# Altium project Slit_Lamp.PrjPcb (part 2 of 2)

## Sheet Motor_PCB.SchDoc: Low Power Motor Driver
size A; DrawnBy: Jesi Miranda-Santos; SheetNumber: 1; SheetTotal: 1
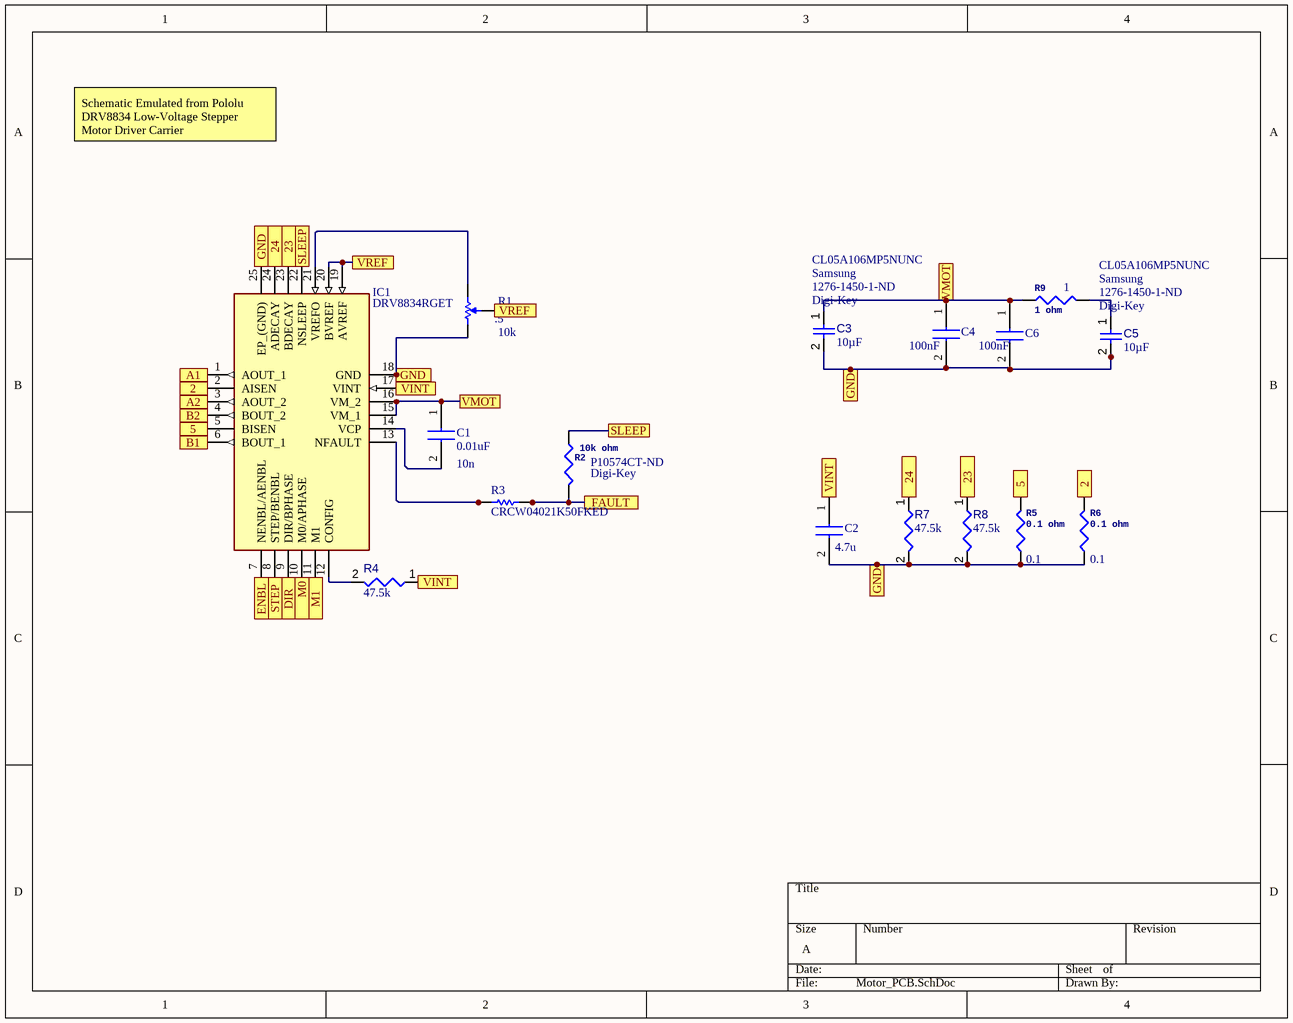
[diagram p1: Motor_PCB.SchDoc]

### Parts
C1  0.01uF  value 10n  [CAP 0603_1608]
C2  value 4.7u  [CAP 0402_1005]  (hidden comment: 0402YD475MAT2A)
C3  value 10µF  Supplier 1: Digi-Key  Supplier Part Number 1: 1276-1450-1-ND  Manufacturer 1: Samsung  Manufacturer Part Number 1: CL05A106MP5NUNC  [CAPC0402(1005)60_L]  (hidden comment: Capacitor 10µF +/-40% 6.3V 0402)
C4  Capacitance: 100nF  [CAP 0603_1608]  (hidden comment: TDK CGA3E2X7R1H104K080AA)
C5  value 10µF  Supplier 1: Digi-Key  Supplier Part Number 1: 1276-1450-1-ND  Manufacturer 1: Samsung  Manufacturer Part Number 1: CL05A106MP5NUNC  [CAPC0402(1005)60_L]  (hidden comment: Capacitor 10µF +/-40% 6.3V 0402)
C6  Capacitance: 100nF  [CAP 0603_1608]  (hidden comment: TDK CGA3E2X7R1H104K080AA)
IC1  DRV8834RGET  [QFN50P400X400X100-25N-D]
R1  value 10k  Set Position: .5  [BI-35WR10KLFTR-3_V]  (hidden comment: 35WR10KLFTR)
R2  10k ohm  Supplier 3: Digi-Key  Supplier Part Number 3: P10574CT-ND  [RES 0805_2012]
R3  CRCW04021K50FKED  [RESC1005X40X25NL05T05]
R4  value 47.5k  [RESC0402(1005)_L]  (hidden comment: Resistor 47K5 +/-1 % 0402 63 mW)
R5  0.1 ohm  value 0.1  [RES 1206_3216]
R6  0.1 ohm  value 0.1  [RES 1206_3216]
R7  value 47.5k  [RESC0402(1005)_L]  (hidden comment: Resistor 47K5 +/-1 % 0402 63 mW)
R8  value 47.5k  [RESC0402(1005)_L]  (hidden comment: Resistor 47K5 +/-1 % 0402 63 mW)
R9  1 ohm  value 1  [RES 0603_1608]

### Ports
2, 5, 23, 24, A1, A2, B1, B2, DIR, ENBL, FAULT, GND, M0, M1, SLEEP, STEP, VINT, VMOT, VREF

### Nets
5V: C1.1 C3.1 C4.1 C6.1 IC1.15(VM_1) IC1.16(VM_2) R9.1 ; port VMOT
GND: C2.2 C3.2 C4.2 C5.2 C6.2 IC1.18(GND) IC1.25(EP_(GND)) R1.1 R5.1 R6.1 R7.2 R8.2 ; port GND
NetC1_2: C1.2 IC1.14(VCP)
NetC2_1: C2.1 IC1.17(VINT) R4.1 ; port VINT
NetC5_1: C5.1 R9.2
NetIC1_1: IC1.1(AOUT_1) ; port A1
NetIC1_2: IC1.2(AISEN) R6.2 ; port 2
NetIC1_3: IC1.3(AOUT_2) ; port A2
NetIC1_4: IC1.4(BOUT_2) ; port B2
NetIC1_5: IC1.5(BISEN) R5.2 ; port 5
NetIC1_6: IC1.6(BOUT_1) ; port B1
NetIC1_7: IC1.7(NENBL/AENBL) ; port ENBL
NetIC1_8: IC1.8(STEP/BENBL) ; port STEP
NetIC1_9: IC1.9(DIR/BPHASE) ; port DIR
NetIC1_10: IC1.10(M0/APHASE) ; port M0
NetIC1_11: IC1.11(M1) ; port M1
NetIC1_12: IC1.12(CONFIG) R4.2
NetIC1_13: IC1.13(NFAULT) R3.1
NetIC1_19: IC1.19(AVREF) IC1.20(BVREF) R1.2 ; port VREF
NetIC1_21: IC1.21(VREFO) R1.3
NetIC1_22: IC1.22(NSLEEP) R2.1 ; port SLEEP
NetIC1_23: IC1.23(BDECAY) R8.1 ; port 23
NetIC1_24: IC1.24(ADECAY) R7.1 ; port 24
NetR2_2: R2.2 R3.2 ; port FAULT

### Notes on the sheet
- Schematic Emulated from Pololu
  DRV8834 Low-Voltage Stepper Motor Driver Carrier

### Library data of the parts
C1 = 06031C103K4T2A: Capacitor 0.01uF / 06031C103K4T2A; Manufacturer_Name: AVX; Datasheet Link: http://www.mouser.com/catalog/supplier/library/pdf/AVXSurfaceMountCeramic.pdf; Height: 0.9mm; Manufacturer_Part_Number: 06031C103K4T2A; Arrow Part Number: 06031C103K4T2A; Arrow Price/Stock: https://www.arrow.com/en/products/06031c103k4t2a/avx; Mouser Part Number: 581-06031C103K4T2A; Mouser Price/Stock: https://www.mouser.com/Search/Refine.aspx?Keyword=581-06031C103K4T2A; Supplier 1: Digi-Key; Supplier Part Number 1: 478-9371-1-ND; Supplier 2: Newark; Supplier Part Number 2: 38AH3523
C2 = 0402YD475MAT2A: Ceramic Capacitor, Multilayer, Ceramic, 6.3V, 20% +Tol, 20% -Tol, X5R, 15% TC, 4.7uF, Surface Mount, 0402; Manufacturer: AVX; Manufacturer 1: Murata; Manufacturer Part Number 1: GRM155R60J475ME47D; Datasheet Link: http://www.mouser.com/catalog/supplier/library/pdf/AVXSurfaceMountCeramic.pdf; Height: 0.56mm; Manufacturer Part Number: 0402YD475MAT2A; Arrow Part Number: 0402YD475MAT2A; Mouser Part Number: 581-0402YD475MAT2A; Mouser Price/Stock: https://www.mouser.co.uk/ProductDetail/AVX/0402YD475MAT2A?qs=s6nfgz3miVxwCmHE9M6tUg%3D%3D; Supplier 2: Future Electronics; Supplier Part Number 2: 0402YD475MAT2A-CUTT; Supplier 1: Arrow; Supplier Part Number 1: GRM155R60J475ME47D; RoHS: Yes; Category: Ceramic Capacitors; Stock 3: 138; Pricing 3: 1=0.09380, 10=0.07840, 25=0.07770, 100=0.05870, 250=0.04460, 500=0.03180, 1000=0.02760, 3000=0.02540 (USD); Mount: Surface Mount; Case/Package: 0402; Weight: 0.000212oz; Case Code (Metric): 1005; Case Code (Imperial): 0402; Contact Plating: Tin; Min Operating Temperature: -55°C; Max Operating Temperature: 85°C; Capacitance: 4.7uF; Tolerance: 20%; Packaging: Tape and Reel; Voltage Rating (DC): 6.3V; Package Quantity: 10000; Voltage Rating: 6.3V; Dielectric: X5R; Termination: SMD/SMT; Voltage: 6.3V; Length: 1mm; Depth: 0.5mm; Width: 0.02inch; Thickness: 0.022inch; REACH SVHC: No SVHC; Lead Free: Lead Free; ComponentLink1URL: https://datasheet.ciiva.com:443/pdfs/VipMasterIC/IC/MURE/MURE-S-A0008911298/MURE-S-A0008911388-1.pdf?src-supplier=IHS+Markit; ComponentLink1Description: https://datasheet.ciiva.com:443/pdfs/VipMasterIC/IC/MURE/MURE-S-A0008911298/MURE-S-A0008911388-1.pdf?src-supplier=IHS+Markit; ComponentLink2URL: https://datasheet.ciiva.com/6270/product-6270483.pdf?src-supplier=Digi-Key; ComponentLink2Description: https://datasheet.ciiva.com/6270/product-6270483.pdf?src-supplier=Digi-Key; ComponentLink3URL: https://datasheet.ciiva.com/6268/partnumbering-e-01-6268378.pdf?src-supplier=Digi-Key; ComponentLink3Description: https://datasheet.ciiva.com/6268/partnumbering-e-01-6268378.pdf?src-supplier=Digi-Key; ComponentLink4URL: https://datasheet.ciiva.com/46418/1769893-46418044.pdf?src-supplier=Element14; ComponentLink4Description: https://datasheet.ciiva.com/46418/1769893-46418044.pdf?src-supplier=Element14; ComponentLink5URL: https://datasheet.ciiva.com/46418/1769893-46418045.pdf?src-supplier=Element14; ComponentLink5Description: https://datasheet.ciiva.com/46418/1769893-46418045.pdf?src-supplier=Element14; ComponentLink6URL: https://datasheet.ciiva.com/6268/partnumbering-e-01-6268382.pdf?src-supplier=Digi-Key; ComponentLink6Description: https://datasheet.ciiva.com/6268/partnumbering-e-01-6268382.pdf?src-supplier=Digi-Key
C3 C5 = CMP-001-00074-2: Chip Capacitor, 10µF +/-40%, 6.3V, 0402, Thickness 0.6 mm; Tolerance: 10%; Capacitance: 10uF; Dielectric: X5R; Max Operating Temperature: 85°C; Pins: 2; Case/Package: 0402; Min Operating Temperature: -55°C; Voltage Rating: 6.3V; Mounting Technology: SMT; RoHS: Yes; Category: Ceramic Capacitors; Stock 1: 40; Pricing 1: 1=0.22000, 10=0.14900, 50=0.08920, 100=0.07540, 500=0.05156, 1000=0.04562, 2500=0.04363, 5000=0.03967 (USD); Mount: Surface Mount; Case Code (Metric): 1005; Case Code (Imperial): 0402; Contact Plating: Tin; Packaging: Tape and Reel; Package Quantity: 1; Termination: Wraparound; Length: 1mm; Width: 0.02inch; Thickness: 0.028inch; Depth: 0.5mm; Radiation Hardening: No; Lead Free: Lead Free; ComponentLink1URL: https://datasheet.ciiva.com:443/pdfs/VipMasterIC/IC/SEMS/SEMS-S-A0008384515/SEMS-S-A0008872829-1.pdf?src-supplier=IHS+Markit; ComponentLink1Description: https://datasheet.ciiva.com:443/pdfs/VipMasterIC/IC/SEMS/SEMS-S-A0008384515/SEMS-S-A0008872829-1.pdf?src-supplier=IHS+Markit; ComponentLink2URL: https://datasheet.ciiva.com/25721/cl05a106mp5nunc-25721584.pdf?src-supplier=Digi-Key; ComponentLink2Description: https://datasheet.ciiva.com/25721/cl05a106mp5nunc-25721584.pdf?src-supplier=Digi-Key; ComponentLink3URL: https://datasheet.ciiva.com/26838/getdatasheetpartid-745310-26838170.pdf?src-supplier=Verical; ComponentLink3Description: https://datasheet.ciiva.com/26838/getdatasheetpartid-745310-26838170.pdf?src-supplier=Verical
C4 C6 = 06031C103K4T2A: Ceramic Capacitor, Multilayer, Ceramic, 50V, 10% +Tol, 10% -Tol, X7R, 15% TC, 0.1uF, Surface Mount, 0603; ComponentLink1URL: https://datasheet.ciiva.com:443/pdfs/VipMasterIC/IC/AVXC/AVXC-S-A0009957027/AVXC-S-A0009957027-1.pdf?src-supplier=IHS+Markit; ComponentLink1Description: https://datasheet.ciiva.com:443/pdfs/VipMasterIC/IC/AVXC/AVXC-S-A0009957027/AVXC-S-A0009957027-1.pdf?src-supplier=IHS+Markit; ComponentLink2URL: https://datasheet.ciiva.com/7855/88813-7855192.pdf?src-supplier=Element14; ComponentLink2Description: https://datasheet.ciiva.com/7855/88813-7855192.pdf?src-supplier=Element14; ComponentLink3URL: https://datasheet.ciiva.com/17490/skycap-sr-17490713.pdf?src-supplier=Avnet+Europe; ComponentLink3Description: https://datasheet.ciiva.com/17490/skycap-sr-17490713.pdf?src-supplier=Avnet+Europe; ComponentLink4URL: https://datasheet.ciiva.com/11508/cauto-11508203.pdf?src-supplier=Avnet; ComponentLink4Description: https://datasheet.ciiva.com/11508/cauto-11508203.pdf?src-supplier=Avnet; ComponentLink5URL: https://datasheet.ciiva.com/46393/681197-46393435.pdf?src-supplier=Element14; ComponentLink5Description: https://datasheet.ciiva.com/46393/681197-46393435.pdf?src-supplier=Element14; ComponentLink6URL: https://datasheet.ciiva.com/45259/cauto-45259484.pdf?src-supplier=Digi-Key; ComponentLink6Description: https://datasheet.ciiva.com/45259/cauto-45259484.pdf?src-supplier=Digi-Key; ComponentLink7URL: https://datasheet.ciiva.com/15212/getdatasheetpartid-560212-15212173.pdf?src-supplier=Verical; ComponentLink7Description: https://datasheet.ciiva.com/15212/getdatasheetpartid-560212-15212173.pdf?src-supplier=Verical; Manufacturer 1: TDK; Manufacturer Part Number 1: CGA3E2X7R1H104K080AA; RoHS: Yes; Category: Ceramic Capacitors; Stock 1: 7591373; Pricing 1: 1=0.10000, 10=0.07600, 50=0.04160, 100=0.03400, 500=0.02426, 1000=0.01906 (USD); Mount: Surface Mount; Case/Package: 0603; Weight: 7.1E-05oz; Case Code (Imperial): 0603; Case Code (Metric): 1608; Min Operating Temperature: -55°C; Max Operating Temperature: 125°C; Tolerance: 10%; Packaging: Tape and Reel; Package Quantity: 1; Voltage Rating: 50V; Dielectric: X7R; Voltage: 50V; Voltage Rating (DC): 50V; Termination: SMD/SMT; Composition: Ceramic; Length: 1.6mm; Height: 0.8mm; Width: 0.8mm; Depth: 0.8mm; Thickness: 0.035inch; Ratings: AEC-Q200; Radiation Hardening: No; Lead Free: Lead Free; REACH SVHC: No SVHC; ComponentLink8URL: https://datasheet.ciiva.com:443/pdfs/VipMasterIC/IC/TDKC/TDKC-S-A0008953915/TDKC-S-A0008953915-1.pdf?src-supplier=IHS+Markit; ComponentLink8Description: https://datasheet.ciiva.com:443/pdfs/VipMasterIC/IC/TDKC/TDKC-S-A0008953915/TDKC-S-A0008953915-1.pdf?src-supplier=IHS+Markit; ComponentLink9URL: https://datasheet.ciiva.com/24216/cga3e2x7r1h104k080aa-266291-24216208.pdf?src-supplier=Mouser; ComponentLink9Description: https://datasheet.ciiva.com/24216/cga3e2x7r1h104k080aa-266291-24216208.pdf?src-supplier=Mouser; ComponentLink10URL: https://datasheet.ciiva.com/15192/getdatasheetpartid-715867-15192412.pdf?src-supplier=Verical; ComponentLink10Description: https://datasheet.ciiva.com/15192/getdatasheetpartid-715867-15192412.pdf?src-supplier=Verical; ComponentLink11URL: https://datasheet.ciiva.com/23803/1936565-23803084.pdf?src-supplier=Newark; ComponentLink11Description: https://datasheet.ciiva.com/23803/1936565-23803084.pdf?src-supplier=Newark; ComponentLink12URL: https://datasheet.ciiva.com/46385/1735392-46385708.pdf?src-supplier=Element14; ComponentLink12Description: https://datasheet.ciiva.com/46385/1735392-46385708.pdf?src-supplier=Element14; ComponentLink13URL: https://datasheet.ciiva.com/16500/mlccspec-automotive-general-midvoltage-en-16500693.pdf?src-supplier=Future+Electronics; ComponentLink13Description: https://datasheet.ciiva.com/16500/mlccspec-automotive-general-midvoltage-en-16500693.pdf?src-supplier=Future+Electronics; ComponentLink14URL: https://datasheet.ciiva.com/22725/1735392-22725642.pdf?src-supplier=Element14; ComponentLink14Description: https://datasheet.ciiva.com/22725/1735392-22725642.pdf?src-supplier=Element14; Supplier 1: Digi-Key; Supplier Part Number 1: 445-5666-1-ND; Supplier 2: Newark; Supplier Part Number 2: 04X3156
IC1 = DRV8834RGET: Brush DC Motor Controller, 2.2A, PQCC24; Manufacturer_Name: Texas Instruments; Logic Function: AND; Operating Supply Current: 2.4mA; Max Collector Current: 1.5A; Collector Emitter Voltage (VCEO): 10.8V; Drain to Source Resistance: 305mR; Interface: Parallel; Number of Outputs: 2; Min Supply Voltage: 2.5V; Max Supply Voltage: 11V; Switching Frequency: 42.5kHz; Motor Type: Stepper; Datasheet Link: http://www.ti.com/lit/ds/symlink/drv8834.pdf; Height: 1mm; Manufacturer_Part_Number: DRV8834RGET; Arrow Part Number: DRV8834RGET; Arrow Price/Stock: https://www.arrow.com/en/products/drv8834rget/texas-instruments; Mouser Part Number: 595-DRV8834RGET; Mouser Price/Stock: https://www.mouser.co.uk/ProductDetail/Texas-Instruments/DRV8834RGET?qs=UFc95S4Z4CavAnnExp%2F5Mg%3D%3D; Supplier 1: Digi-Key; Supplier Part Number 1: 296-37691-1-ND; Supplier 2: Digi-Key; Supplier Part Number 2: 296-37691-2-ND; Manufacturer 2: Texas Instruments; Manufacturer Part Number 2: DRV8834RGET; RoHS: Yes; Category: Integrated Circuits (ICs); Stock 2: 472; Pricing 2: 250=1.71812, 500=1.65600, 1250=1.37655 (USD); Mount: Surface Mount; Case/Package: VQFN; Number of Pins: 24; Weight: 0.001926oz; Min Operating Temperature: -40°C; Max Operating Temperature: 85°C; Operating Supply Voltage: 10.8V; Package Quantity: 250; Packaging: Tape and Reel; Output Current: 1.5A; Length: 4.15mm; Width: 4.15mm; Radiation Hardening: No; Lead Free: Lead Free; REACH SVHC: No SVHC; ComponentLink1URL: https://www.ti.com:443/lit/ds/symlink/drv8834.pdf?src-supplier=IHS+Markit; ComponentLink1Description: https://www.ti.com:443/lit/ds/symlink/drv8834.pdf?src-supplier=IHS+Markit; ComponentLink2URL: https://datasheet.ciiva.com/7977/1636656-7977700.pdf?src-supplier=Element14; ComponentLink2Description: https://datasheet.ciiva.com/7977/1636656-7977700.pdf?src-supplier=Element14; ComponentLink3URL: https://datasheet.ciiva.com/30476/0900766b8119b043-30476811.pdf?src-supplier=RSComponents; ComponentLink3Description: https://datasheet.ciiva.com/30476/0900766b8119b043-30476811.pdf?src-supplier=RSComponents; ComponentLink4URL: https://datasheet.ciiva.com/15109/getdatasheetpartid-518476-15109583.pdf?src-supplier=Verical; ComponentLink4Description: https://datasheet.ciiva.com/15109/getdatasheetpartid-518476-15109583.pdf?src-supplier=Verical; ComponentLink5URL: https://datasheet.ciiva.com/14266/drv8834-14266555.pdf?src-supplier=Avnet; ComponentLink5Description: https://datasheet.ciiva.com/14266/drv8834-14266555.pdf?src-supplier=Avnet; ComponentLink6URL: https://datasheet.ciiva.com/41798/drv8834-41798879.pdf?src-supplier=Digi-Key; ComponentLink6Description: https://datasheet.ciiva.com/41798/drv8834-41798879.pdf?src-supplier=Digi-Key
R1 = CMP-009-00041-1: 3 mm Single-Turn Open Frame Surface Mount Cermet Trimming Potentiometer, +/- 25%, 35 W, -40 to 125 degC, 3-Pin SMD, RoHS, Tape and Reel; Manufacturer: BI Technologies; Manufacturer 1: TT BI; Power: 100mW; Voltage Rating: 50V; Temperature Coefficient: 250ppm/°C; Number of Turns: 1; Insulation Resistance: 100MR; Datasheet Version: Feb-10; Min Operating Temperature: -40°C; Package Description: 3-Pin Surface Mount Device, Body 3 x 3.1 mm; RoHS Compliant: True; Package Quantity: 2000; Case/Package: 35WR10KLFTR; Tolerance: 25%; Resistance: 10k; Datasheet URL: http://www.bitechnologies.com/pdfs/35.pdf; Max Operating Temperature: 125°C; Manufacturer URL: http://www.bi-technologies.net/; Composition: Potentiometer; Package Reference: 35WR10KLFTR; Mounting Technology: SM; Packaging: TapeandReel; Supplier 1: Digi-Key; Supplier Part Number 1: 987-1694-1-ND; Manufacturer Part Number 1: 35WR10KLFTR; RoHS: Yes; Category: Variable Resistors and Potentiometers; Stock 1: 6315; Pricing 1: 1=0.38000, 10=0.35300, 25=0.31800, 50=0.30740, 100=0.29680, 250=0.27560, 500=0.25440, 1000=0.23850 (USD); Mount: Surface Mount; Power Rating: 100mW; Voltage Rating (DC): 50V; Max Power Dissipation: 100mW; Type: Potentiometer; Termination: SMD/SMT; Military Standard: Not; Length: 3mm; Depth: 3.65mm; Width: 1.55mm; Radiation Hardening: No; Lead Free: Lead Free; REACH SVHC: No SVHC; ComponentLink1URL: https://datasheet.ciiva.com:443/pdfs/VipMasterIC/IC/TTRB/TTRB-S-A0009778036/TTRB-S-A0009778036-1.pdf?src-supplier=IHS+Markit; ComponentLink1Description: https://datasheet.ciiva.com:443/pdfs/VipMasterIC/IC/TTRB/TTRB-S-A0009778036/TTRB-S-A0009778036-1.pdf?src-supplier=IHS+Markit; ComponentLink2URL: https://datasheet.ciiva.com/8020/4701-8020822.pdf?src-supplier=Element14; ComponentLink2Description: https://datasheet.ciiva.com/8020/4701-8020822.pdf?src-supplier=Element14; ComponentLink3URL: https://datasheet.ciiva.com/7634/4701-7634923.pdf?src-supplier=Element14; ComponentLink3Description: https://datasheet.ciiva.com/7634/4701-7634923.pdf?src-supplier=Element14; ComponentLink4URL: https://datasheet.ciiva.com/26859/getdatasheetpartid-736457-26859612.pdf?src-supplier=Verical; ComponentLink4Description: https://datasheet.ciiva.com/26859/getdatasheetpartid-736457-26859612.pdf?src-supplier=Verical; ComponentLink5URL: https://datasheet.ciiva.com/22715/4701-22715102.pdf?src-supplier=Element14; ComponentLink5Description: https://datasheet.ciiva.com/22715/4701-22715102.pdf?src-supplier=Element14
R2 = 10k ohm: NTC Thermistor, 10000ohm, Surface Mount; Tolerance: 5%; Resistance: 10kR; Power Rating: 66mW; Accuracy: 2%; Supplier 1: Digi-Key; Supplier Part Number 1: 541-10.0KCCT-ND; Supplier 2: Newark; Supplier Part Number 2: 64AH3432; Manufacturer 2: Panasonic; Manufacturer Part Number 2: ERT-J0ER103J; RoHS: Yes; Category: Thermistors; Stock 2: 460; Pricing 2: 1=0.08000, 10=0.06900, 25=0.06300, 50=0.05000, 100=0.04300, 250=0.04000, 500=0.03800, 1000=0.03200 (USD); Mount: Surface Mount; Case/Package: 0402; Number of Pins: 2; Case Code (Metric): 1005; Case Code (Imperial): 0402; Contact Plating: Tin; Min Operating Temperature: -40°C; Max Operating Temperature: 125°C; Packaging: Tape and Reel; Package Quantity: 10000; Termination: SMD/SMT; Max Power Dissipation: 66mW; Length: 1mm; Depth: 0.5mm; Width: 500um; Radiation Hardening: No; Lead Free: Lead Free; ComponentLink1URL: https://datasheet.ciiva.com:443/pdfs/VipMasterIC/IC/PANA/PANA-S-A0009459411/PANA-S-A0009459411-1.pdf?src-supplier=IHS+Markit; ComponentLink1Description: https://datasheet.ciiva.com:443/pdfs/VipMasterIC/IC/PANA/PANA-S-A0009459411/PANA-S-A0009459411-1.pdf?src-supplier=IHS+Markit; ComponentLink2URL: https://datasheet.ciiva.com/15097/getdatasheetpartid-366429-15097813.pdf?src-supplier=Verical; ComponentLink2Description: https://datasheet.ciiva.com/15097/getdatasheetpartid-366429-15097813.pdf?src-supplier=Verical; ComponentLink3URL: https://datasheet.ciiva.com/1303/1314428-1303096.pdf?src-supplier=Farnell; ComponentLink3Description: https://datasheet.ciiva.com/1303/1314428-1303096.pdf?src-supplier=Farnell; ComponentLink4URL: https://datasheet.ciiva.com/3280/aua0000ce1-3280447.pdf?src-supplier=Avnet; ComponentLink4Description: https://datasheet.ciiva.com/3280/aua0000ce1-3280447.pdf?src-supplier=Avnet; ComponentLink5URL: https://datasheet.ciiva.com/1322/1314428-1322547.pdf?src-supplier=Element14; ComponentLink5Description: https://datasheet.ciiva.com/1322/1314428-1322547.pdf?src-supplier=Element14; ComponentLink6URL: https://datasheet.ciiva.com/24006/aua0000ce1-33779-24006229.pdf?src-supplier=Mouser; ComponentLink6Description: https://datasheet.ciiva.com/24006/aua0000ce1-33779-24006229.pdf?src-supplier=Mouser; ComponentLink7URL: https://datasheet.ciiva.com/16470/aua0000ce1-16470570.pdf?src-supplier=Avnet+Asia; ComponentLink7Description: https://datasheet.ciiva.com/16470/aua0000ce1-16470570.pdf?src-supplier=Avnet+Asia; ComponentLink8URL: https://datasheet.ciiva.com/3280/aua0000ce1-3280446.pdf?src-supplier=Avnet; ComponentLink8Description: https://datasheet.ciiva.com/3280/aua0000ce1-3280446.pdf?src-supplier=Avnet; ComponentLink9URL: https://datasheet.ciiva.com/2848/aua0000ce1-2848304.pdf?src-supplier=Digi-Key; ComponentLink9Description: https://datasheet.ciiva.com/2848/aua0000ce1-2848304.pdf?src-supplier=Digi-Key; ComponentLink10URL: https://datasheet.ciiva.com/2848/aua0000ce1-2848305.pdf?src-supplier=Digi-Key; ComponentLink10Description: https://datasheet.ciiva.com/2848/aua0000ce1-2848305.pdf?src-supplier=Digi-Key; ComponentLink11URL: https://datasheet.ciiva.com/2848/aua0000ce1-2848306.pdf?src-supplier=Digi-Key; ComponentLink11Description: https://datasheet.ciiva.com/2848/aua0000ce1-2848306.pdf?src-supplier=Digi-Key; ComponentLink12URL: https://datasheet.ciiva.com/1303/1314428-1303097.pdf?src-supplier=Farnell; ComponentLink12Description: https://datasheet.ciiva.com/1303/1314428-1303097.pdf?src-supplier=Farnell; ComponentLink13URL: https://datasheet.ciiva.com/16634/aua0000ce1-16634813.pdf?src-supplier=Avnet+Europe; ComponentLink13Description: https://datasheet.ciiva.com/16634/aua0000ce1-16634813.pdf?src-supplier=Avnet+Europe; ComponentLink14URL: https://datasheet.ciiva.com/30223/aua0000ce1-30223743.pdf?src-supplier=Onlinecomponents.com; ComponentLink14Description: https://datasheet.ciiva.com/30223/aua0000ce1-30223743.pdf?src-supplier=Onlinecomponents.com
R3 = CMP-2002-08297-1: Manufacturer: Vishay Dale; Manufacturer 1: Vishay; Tolerance: 1%; Resistance: 1.5kR; Power Rating: 63mW; Temperature Coefficient: 100ppm/°C; Voltage Rating: 50V; Part Number: CRCW04021K50FKED; Supplier 1: Digi-Key; Supplier Part Number 1: 541-1.50KLCT-ND; Manufacturer Part Number 1: CRCW04021K50FKED; RoHS: Yes; Category: Chip SMD Resistors; Stock 1: 43595; Pricing 1: 1=0.10000, 10=0.03500, 100=0.01410, 1000=0.00633, 2500=0.00550, 5000=0.00454 (USD); Mount: Surface Mount; Case/Package: 0402; Weight: 2.3E-05oz; Case Code (Metric): 1005; Case Code (Imperial): 0402; Contact Plating: Tin; Min Operating Temperature: -55°C; Max Operating Temperature: 155°C; Packaging: Tape and Reel; Termination: SMD/SMT; Package Quantity: 10; Military Standard: Not; Composition: Thick Film; Number of Terminations: 2; Max Power Dissipation: 63mW; Voltage Rating (DC): 50V; Features: Automotive AEC-Q200; Working Voltage: 50V; Length: 1mm; Height: 0.35mm; Width: 0.02inch; Depth: 0.5mm; Radiation Hardening: No; REACH SVHC: Unknown; Lead Free: Lead Free; ComponentLink1URL: https://datasheet.ciiva.com:443/pdfs/VipMasterIC/IC/VISH/VISH-S-A0007266705/VISH-S-A0007266705-1.pdf?src-supplier=IHS+Markit; ComponentLink1Description: https://datasheet.ciiva.com:443/pdfs/VipMasterIC/IC/VISH/VISH-S-A0007266705/VISH-S-A0007266705-1.pdf?src-supplier=IHS+Markit; ComponentLink2URL: https://datasheet.ciiva.com/11810/0900766b80d98824-11810393.pdf?src-supplier=RSComponents; ComponentLink2Description: https://datasheet.ciiva.com/11810/0900766b80d98824-11810393.pdf?src-supplier=RSComponents; ComponentLink3URL: https://datasheet.ciiva.com/2463/dcrcwe3-2463317.pdf?src-supplier=Digi-Key; ComponentLink3Description: https://datasheet.ciiva.com/2463/dcrcwe3-2463317.pdf?src-supplier=Digi-Key; ComponentLink4URL: https://datasheet.ciiva.com/2463/dcrcwe3-2463318.pdf?src-supplier=Digi-Key; ComponentLink4Description: https://datasheet.ciiva.com/2463/dcrcwe3-2463318.pdf?src-supplier=Digi-Key; ComponentLink5URL: https://datasheet.ciiva.com/26316/fld-crcw-e3-data-en-26316648.pdf?src-supplier=Distrelec; ComponentLink5Description: https://datasheet.ciiva.com/26316/fld-crcw-e3-data-en-26316648.pdf?src-supplier=Distrelec; ComponentLink6URL: https://datasheet.ciiva.com/3256/dcrcwe3-3256170.pdf?src-supplier=Avnet; ComponentLink6Description: https://datasheet.ciiva.com/3256/dcrcwe3-3256170.pdf?src-supplier=Avnet; ComponentLink7URL: https://datasheet.ciiva.com/3256/dcrcwe3-3256171.pdf?src-supplier=Avnet; ComponentLink7Description: https://datasheet.ciiva.com/3256/dcrcwe3-3256171.pdf?src-supplier=Avnet; ComponentLink8URL: https://datasheet.ciiva.com/16514/dcrcwe3-16514942.pdf?src-supplier=Avnet+Asia; ComponentLink8Description: https://datasheet.ciiva.com/16514/dcrcwe3-16514942.pdf?src-supplier=Avnet+Asia; ComponentLink9URL: https://datasheet.ciiva.com/16755/70201119-16755551.pdf?src-supplier=Allied+Electronics; ComponentLink9Description: https://datasheet.ciiva.com/16755/70201119-16755551.pdf?src-supplier=Allied+Electronics; ComponentLink10URL: https://datasheet.ciiva.com/2463/dcrcwe3-2463316.pdf?src-supplier=Digi-Key; ComponentLink10Description: https://datasheet.ciiva.com/2463/dcrcwe3-2463316.pdf?src-supplier=Digi-Key; ComponentLink11URL: https://datasheet.ciiva.com/5540/dcrcwe3-109170-5540969.pdf?src-supplier=Mouser; ComponentLink11Description: https://datasheet.ciiva.com/5540/dcrcwe3-109170-5540969.pdf?src-supplier=Mouser; Supplier 2: Newark; Supplier Part Number 2: 25AC6939
R4 = CMP-009-00137-2: Chip Resistor, 47,5 kOhms, +/-1 %, 63 mW, -55 to 155 degC, 0402; Manufacturer 1: Panasonic; Manufacturer Part Number 1: ERT-J0EP473J; Tolerance: 1%; Power: 63mW; Resistance: 47kR; Max Power Dissipation: 66mW; Accuracy: 2%; Power Rating: 100mW; Voltage Rating: 75V; Temperature Coefficient: 100ppm/°C; Pins: 2; Case/Package: 0402; Max Operating Temperature: 155°C; Min Operating Temperature: -55°C; Supplier 1: Digi-Key; Supplier Part Number 1: P11441CT-ND; RoHS: Yes; Category: Thermistors; Stock 1: 18779; Pricing 1: 1=0.18000, 5=0.17400, 10=0.15400, 25=0.14200, 50=0.11360, 100=0.09740, 500=0.08524, 1000=0.07306, 5000=0.06494 (USD); Mount: Surface Mount; Number of Pins: 2; Case Code (Metric): 1005; Case Code (Imperial): 0402; Contact Plating: Tin; Packaging: Tape and Reel; Package Quantity: 10000; Termination: SMD/SMT; Length: 1mm; Width: 500um; Depth: 0.5mm; Radiation Hardening: No; Lead Free: Lead Free; ComponentLink1URL: https://datasheet.ciiva.com:443/pdfs/VipMasterIC/IC/PANA/PANA-S-A0009459411/PANA-S-A0009459411-1.pdf?src-supplier=IHS+Markit; ComponentLink1Description: https://datasheet.ciiva.com:443/pdfs/VipMasterIC/IC/PANA/PANA-S-A0009459411/PANA-S-A0009459411-1.pdf?src-supplier=IHS+Markit; ComponentLink2URL: https://datasheet.ciiva.com/1322/1314428-1322546.pdf?src-supplier=Element14; ComponentLink2Description: https://datasheet.ciiva.com/1322/1314428-1322546.pdf?src-supplier=Element14; ComponentLink3URL: https://datasheet.ciiva.com/1303/1314428-1303079.pdf?src-supplier=Farnell; ComponentLink3Description: https://datasheet.ciiva.com/1303/1314428-1303079.pdf?src-supplier=Farnell; ComponentLink4URL: https://datasheet.ciiva.com/1303/1314428-1303080.pdf?src-supplier=Farnell; ComponentLink4Description: https://datasheet.ciiva.com/1303/1314428-1303080.pdf?src-supplier=Farnell; ComponentLink5URL: https://datasheet.ciiva.com/26928/getdatasheetpartid-776115-26928332.pdf?src-supplier=Verical; ComponentLink5Description: https://datasheet.ciiva.com/26928/getdatasheetpartid-776115-26928332.pdf?src-supplier=Verical; ComponentLink6URL: https://datasheet.ciiva.com/3280/aua0000ce1-3280445.pdf?src-supplier=Avnet; ComponentLink6Description: https://datasheet.ciiva.com/3280/aua0000ce1-3280445.pdf?src-supplier=Avnet; ComponentLink7URL: https://datasheet.ciiva.com/2848/aua0000ce1-2848303.pdf?src-supplier=Digi-Key; ComponentLink7Description: https://datasheet.ciiva.com/2848/aua0000ce1-2848303.pdf?src-supplier=Digi-Key; ComponentLink8URL: https://datasheet.ciiva.com/16470/aua0000ce1-16470568.pdf?src-supplier=Avnet+Asia; ComponentLink8Description: https://datasheet.ciiva.com/16470/aua0000ce1-16470568.pdf?src-supplier=Avnet+Asia; ComponentLink9URL: https://datasheet.ciiva.com/2848/aua0000ce1-2848301.pdf?src-supplier=Digi-Key; ComponentLink9Description: https://datasheet.ciiva.com/2848/aua0000ce1-2848301.pdf?src-supplier=Digi-Key; ComponentLink10URL: https://datasheet.ciiva.com/2848/aua0000ce1-2848302.pdf?src-supplier=Digi-Key; ComponentLink10Description: https://datasheet.ciiva.com/2848/aua0000ce1-2848302.pdf?src-supplier=Digi-Key; Supplier 2: Digi-Key; Supplier Part Number 2: 541-47.0HCT-ND; Manufacturer 2: Vishay; Manufacturer Part Number 2: CRCW060347R0FKEA; Stock 2: 1712; Pricing 2: 1=0.10000, 10=0.03300, 100=0.01340, 1000=0.00602, 2500=0.00522 (USD); Weight: 7.1E-05oz; Composition: Thick Film; Military Standard: Not; Number of Terminations: 2; Features: Automotive AEC-Q200; Voltage Rating (DC): 75V; Height: 0.45mm; REACH SVHC: Unknown; ComponentLink11URL: https://datasheet.ciiva.com:443/pdfs/VipMasterIC/IC/VISH/VISH-S-A0007266705/VISH-S-A0007266705-1.pdf?src-supplier=IHS+Markit; ComponentLink11Description: https://datasheet.ciiva.com:443/pdfs/VipMasterIC/IC/VISH/VISH-S-A0007266705/VISH-S-A0007266705-1.pdf?src-supplier=IHS+Markit; ComponentLink12URL: https://datasheet.ciiva.com/11810/0900766b80d98afc-11810171.pdf?src-supplier=RSComponents; ComponentLink12Description: https://datasheet.ciiva.com/11810/0900766b80d98afc-11810171.pdf?src-supplier=RSComponents; ComponentLink13URL: https://datasheet.ciiva.com/3257/dcrcwe3-3257637.pdf?src-supplier=Avnet; ComponentLink13Description: https://datasheet.ciiva.com/3257/dcrcwe3-3257637.pdf?src-supplier=Avnet; ComponentLink14URL: https://datasheet.ciiva.com/7777/1697337-7777333.pdf?src-supplier=Element14; ComponentLink14Description: https://datasheet.ciiva.com/7777/1697337-7777333.pdf?src-supplier=Element14; ComponentLink15URL: https://datasheet.ciiva.com/22872/70201119-22872069.pdf?src-supplier=Allied+Electronics; ComponentLink15Description: https://datasheet.ciiva.com/22872/70201119-22872069.pdf?src-supplier=Allied+Electronics; ComponentLink16URL: https://datasheet.ciiva.com/7777/1697337-7777334.pdf?src-supplier=Element14; ComponentLink16Description: https://datasheet.ciiva.com/7777/1697337-7777334.pdf?src-supplier=Element14; ComponentLink17URL: https://datasheet.ciiva.com/2465/dcrcwe3-2465675.pdf?src-supplier=Digi-Key; ComponentLink17Description: https://datasheet.ciiva.com/2465/dcrcwe3-2465675.pdf?src-supplier=Digi-Key; ComponentLink18URL: https://datasheet.ciiva.com/2465/dcrcwe3-2465676.pdf?src-supplier=Digi-Key; ComponentLink18Description: https://datasheet.ciiva.com/2465/dcrcwe3-2465676.pdf?src-supplier=Digi-Key; ComponentLink19URL: https://datasheet.ciiva.com/5549/dcrcwe3-109170-5549100.pdf?src-supplier=Mouser; ComponentLink19Description: https://datasheet.ciiva.com/5549/dcrcwe3-109170-5549100.pdf?src-supplier=Mouser; ComponentLink20URL: https://datasheet.ciiva.com/16777/70201119-16777404.pdf?src-supplier=Allied+Electronics; ComponentLink20Description: https://datasheet.ciiva.com/16777/70201119-16777404.pdf?src-supplier=Allied+Electronics; ComponentLink21URL: https://datasheet.ciiva.com/22700/1697337-22700364.pdf?src-supplier=Element14; ComponentLink21Description: https://datasheet.ciiva.com/22700/1697337-22700364.pdf?src-supplier=Element14; ComponentLink22URL: https://datasheet.ciiva.com/2465/dcrcwe3-2465677.pdf?src-supplier=Digi-Key; ComponentLink22Description: https://datasheet.ciiva.com/2465/dcrcwe3-2465677.pdf?src-supplier=Digi-Key; ComponentLink23URL: https://datasheet.ciiva.com/26316/fld-crcw-e3-data-en-26316558.pdf?src-supplier=Distrelec; ComponentLink23Description: https://datasheet.ciiva.com/26316/fld-crcw-e3-data-en-26316558.pdf?src-supplier=Distrelec
R5 R6 = .1 ohm RES: Fixed Resistor, Metal Strip, 0.25W, 0.1ohm, 1% +/-Tol, 75ppm/Cel, Surface Mount, 1206; Manufacturer 1: Vishay Dale; Manufacturer Part Number 1: WSL1206R1000FEA; Resistance: 100mR; Temperature Coefficient: 75ppm/°C; Power Rating: 250mW; Voltage Rating: 150mV; Supplier 2: Digi-Key; Supplier Part Number 2: P.10AUDKR-ND; Supplier 1: Newark; Supplier Part Number 1: 26AC5227; RoHS: Yes; Category: Chip SMD Resistors; Stock 3: 28000; Pricing 3: 1=0.25600, 4000=0.24900, 8000=0.23700, 16000=0.23400, 24000=0.23100 (USD); Mount: Surface Mount; Case/Package: 1206; Number of Pins: 2; Weight: 0.000571oz; Contact Plating: Tin,Matte; Case Code (Imperial): 1206; Case Code (Metric): 3216; Min Operating Temperature: -65°C; Max Operating Temperature: 170°C; Tolerance: 1%; Composition: Metal Strip; Packaging: Tape and Reel; Package Quantity: 4000; Termination: SMD/SMT; Military Standard: Not; Length: 3.2mm; Height: 0.635mm; Width: 1.6mm; Depth: 1.6mm; Radiation Hardening: No; Lead Free: Lead Free; REACH SVHC: Unknown; ComponentLink1URL: https://datasheet.ciiva.com:443/pdfs/VipMasterIC/IC/VISH/VISH-S-A0009736187/VISH-S-A0009736187-1.pdf?src-supplier=IHS+Markit; ComponentLink1Description: https://datasheet.ciiva.com:443/pdfs/VipMasterIC/IC/VISH/VISH-S-A0009736187/VISH-S-A0009736187-1.pdf?src-supplier=IHS+Markit; ComponentLink2URL: https://datasheet.ciiva.com/46422/442550-46422266.pdf?src-supplier=Element14; ComponentLink2Description: https://datasheet.ciiva.com/46422/442550-46422266.pdf?src-supplier=Element14; ComponentLink3URL: https://datasheet.ciiva.com/8979/wsl-8979884.pdf?src-supplier=Avnet; ComponentLink3Description: https://datasheet.ciiva.com/8979/wsl-8979884.pdf?src-supplier=Avnet; ComponentLink4URL: https://datasheet.ciiva.com/17171/wsl-17171769.pdf?src-supplier=Avnet+Europe; ComponentLink4Description: https://datasheet.ciiva.com/17171/wsl-17171769.pdf?src-supplier=Avnet+Europe; ComponentLink5URL: https://datasheet.ciiva.com/46385/622543-46385258.pdf?src-supplier=Element14; ComponentLink5Description: https://datasheet.ciiva.com/46385/622543-46385258.pdf?src-supplier=Element14; ComponentLink6URL: https://datasheet.ciiva.com/46422/442550-46422267.pdf?src-supplier=Element14; ComponentLink6Description: https://datasheet.ciiva.com/46422/442550-46422267.pdf?src-supplier=Element14; ComponentLink7URL: https://datasheet.ciiva.com/16215/wsl-16215631.pdf?src-supplier=Future+Electronics; ComponentLink7Description: https://datasheet.ciiva.com/16215/wsl-16215631.pdf?src-supplier=Future+Electronics
R7 R8 = CMP-009-00137-2: Chip Resistor, 47,5 kOhms, +/-1 %, 63 mW, -55 to 155 degC, 0402; Manufacturer 1: Vishay; Manufacturer Part Number 1: CRCW060347R0FKEA; Tolerance: 1%; Power: 63mW; Resistance: 47R; Max Power Dissipation: 100mW; Voltage Rating: 75V; Temperature Coefficient: 100ppm/°C; Pins: 2; Case/Package: 0402; Max Operating Temperature: 155°C; Min Operating Temperature: -55°C; Supplier 1: Digi-Key; Supplier Part Number 1: 541-47.0HCT-ND; RoHS: Yes; Category: Chip SMD Resistors; Stock 1: 1712; Pricing 1: 1=0.10000, 10=0.03300, 100=0.01340, 1000=0.00602, 2500=0.00522 (USD); Mount: Surface Mount; Number of Pins: 2; Weight: 7.1E-05oz; Case Code (Metric): 1608; Case Code (Imperial): 0603; Contact Plating: Tin; Packaging: Tape and Reel; Package Quantity: 10; Termination: SMD/SMT; Composition: Thick Film; Military Standard: Not; Power Rating: 100mW; Number of Terminations: 2; Features: Automotive AEC-Q200; Voltage Rating (DC): 75V; Length: 1.55mm; Height: 0.45mm; Width: 0.033inch; Depth: 0.85mm; Radiation Hardening: No; REACH SVHC: Unknown; Lead Free: Lead Free; ComponentLink1URL: https://datasheet.ciiva.com:443/pdfs/VipMasterIC/IC/VISH/VISH-S-A0007266705/VISH-S-A0007266705-1.pdf?src-supplier=IHS+Markit; ComponentLink1Description: https://datasheet.ciiva.com:443/pdfs/VipMasterIC/IC/VISH/VISH-S-A0007266705/VISH-S-A0007266705-1.pdf?src-supplier=IHS+Markit; ComponentLink2URL: https://datasheet.ciiva.com/11810/0900766b80d98afc-11810171.pdf?src-supplier=RSComponents; ComponentLink2Description: https://datasheet.ciiva.com/11810/0900766b80d98afc-11810171.pdf?src-supplier=RSComponents; ComponentLink3URL: https://datasheet.ciiva.com/3257/dcrcwe3-3257637.pdf?src-supplier=Avnet; ComponentLink3Description: https://datasheet.ciiva.com/3257/dcrcwe3-3257637.pdf?src-supplier=Avnet; ComponentLink4URL: https://datasheet.ciiva.com/7777/1697337-7777333.pdf?src-supplier=Element14; ComponentLink4Description: https://datasheet.ciiva.com/7777/1697337-7777333.pdf?src-supplier=Element14; ComponentLink5URL: https://datasheet.ciiva.com/22872/70201119-22872069.pdf?src-supplier=Allied+Electronics; ComponentLink5Description: https://datasheet.ciiva.com/22872/70201119-22872069.pdf?src-supplier=Allied+Electronics; ComponentLink6URL: https://datasheet.ciiva.com/7777/1697337-7777334.pdf?src-supplier=Element14; ComponentLink6Description: https://datasheet.ciiva.com/7777/1697337-7777334.pdf?src-supplier=Element14; ComponentLink7URL: https://datasheet.ciiva.com/2465/dcrcwe3-2465675.pdf?src-supplier=Digi-Key; ComponentLink7Description: https://datasheet.ciiva.com/2465/dcrcwe3-2465675.pdf?src-supplier=Digi-Key; ComponentLink8URL: https://datasheet.ciiva.com/2465/dcrcwe3-2465676.pdf?src-supplier=Digi-Key; ComponentLink8Description: https://datasheet.ciiva.com/2465/dcrcwe3-2465676.pdf?src-supplier=Digi-Key; ComponentLink9URL: https://datasheet.ciiva.com/5549/dcrcwe3-109170-5549100.pdf?src-supplier=Mouser; ComponentLink9Description: https://datasheet.ciiva.com/5549/dcrcwe3-109170-5549100.pdf?src-supplier=Mouser; ComponentLink10URL: https://datasheet.ciiva.com/16777/70201119-16777404.pdf?src-supplier=Allied+Electronics; ComponentLink10Description: https://datasheet.ciiva.com/16777/70201119-16777404.pdf?src-supplier=Allied+Electronics; ComponentLink11URL: https://datasheet.ciiva.com/22700/1697337-22700364.pdf?src-supplier=Element14; ComponentLink11Description: https://datasheet.ciiva.com/22700/1697337-22700364.pdf?src-supplier=Element14; ComponentLink12URL: https://datasheet.ciiva.com/2465/dcrcwe3-2465677.pdf?src-supplier=Digi-Key; ComponentLink12Description: https://datasheet.ciiva.com/2465/dcrcwe3-2465677.pdf?src-supplier=Digi-Key; ComponentLink13URL: https://datasheet.ciiva.com/26316/fld-crcw-e3-data-en-26316558.pdf?src-supplier=Distrelec; ComponentLink13Description: https://datasheet.ciiva.com/26316/fld-crcw-e3-data-en-26316558.pdf?src-supplier=Distrelec
R9 = 1 ohm RES: Fixed Resistor, Metal Glaze/thick Film, 0.1W, 1ohm, 75V, 1% +/-Tol, 100ppm/Cel, Surface Mount, 0603; Resistance: 1R; Power Rating: 100mW; Temperature Coefficient: 100ppm/°C; Manufacturer 2: Vishay Dale; Manufacturer Part Number 2: CRCW06031R00FKEA; RoHS: Yes; Category: Chip SMD Resistors; Stock 2: 110000; Pricing 2: 5000=0.00400, 10000=0.00400 (USD); Mount: Surface Mount; Case/Package: 0603; Number of Pins: 2; Weight: 7.1E-05oz; Case Code (Metric): 1608; Case Code (Imperial): 0603; Contact Plating: Tin; Min Operating Temperature: -55°C; Max Operating Temperature: 155°C; Packaging: Tape and Reel; Tolerance: 1%; Package Quantity: 10; Composition: Thick Film; Termination: SMD/SMT; Number of Terminations: 2; Military Standard: Not; Max Power Dissipation: 100mW; Voltage Rating: 75V; Features: Automotive AEC-Q200; Voltage Rating (DC): 75V; Length: 1.55mm; Height: 0.02inch; Depth: 0.85mm; Width: 0.033inch; Radiation Hardening: No; REACH SVHC: Unknown; Lead Free: Lead Free; ComponentLink1URL: https://datasheet.ciiva.com:443/pdfs/VipMasterIC/IC/VISH/VISH-S-A0007266705/VISH-S-A0007266705-1.pdf?src-supplier=IHS+Markit; ComponentLink1Description: https://datasheet.ciiva.com:443/pdfs/VipMasterIC/IC/VISH/VISH-S-A0007266705/VISH-S-A0007266705-1.pdf?src-supplier=IHS+Markit; ComponentLink2URL: https://datasheet.ciiva.com/7792/1359337-7792119.pdf?src-supplier=Element14; ComponentLink2Description: https://datasheet.ciiva.com/7792/1359337-7792119.pdf?src-supplier=Element14; ComponentLink3URL: https://datasheet.ciiva.com/2465/dcrcwe3-2465529.pdf?src-supplier=Digi-Key; ComponentLink3Description: https://datasheet.ciiva.com/2465/dcrcwe3-2465529.pdf?src-supplier=Digi-Key; ComponentLink4URL: https://datasheet.ciiva.com/3257/dcrcwe3-3257225.pdf?src-supplier=Avnet; ComponentLink4Description: https://datasheet.ciiva.com/3257/dcrcwe3-3257225.pdf?src-supplier=Avnet; ComponentLink5URL: https://datasheet.ciiva.com/16883/dcrcwe3-16883290.pdf?src-supplier=Avnet+Europe; ComponentLink5Description: https://datasheet.ciiva.com/16883/dcrcwe3-16883290.pdf?src-supplier=Avnet+Europe; ComponentLink6URL: https://datasheet.ciiva.com/16768/70201119-16768957.pdf?src-supplier=Allied+Electronics; ComponentLink6Description: https://datasheet.ciiva.com/16768/70201119-16768957.pdf?src-supplier=Allied+Electronics; ComponentLink7URL: https://datasheet.ciiva.com/28621/1747939-28621389.pdf?src-supplier=Element14; ComponentLink7Description: https://datasheet.ciiva.com/28621/1747939-28621389.pdf?src-supplier=Element14; ComponentLink8URL: https://datasheet.ciiva.com/5541/dcrcwe3-109170-5541726.pdf?src-supplier=Mouser; ComponentLink8Description: https://datasheet.ciiva.com/5541/dcrcwe3-109170-5541726.pdf?src-supplier=Mouser; ComponentLink9URL: https://datasheet.ciiva.com/2465/dcrcwe3-2465528.pdf?src-supplier=Digi-Key; ComponentLink9Description: https://datasheet.ciiva.com/2465/dcrcwe3-2465528.pdf?src-supplier=Digi-Key; ComponentLink10URL: https://datasheet.ciiva.com/2465/dcrcwe3-2465530.pdf?src-supplier=Digi-Key; ComponentLink10Description: https://datasheet.ciiva.com/2465/dcrcwe3-2465530.pdf?src-supplier=Digi-Key; ComponentLink11URL: https://datasheet.ciiva.com/3257/dcrcwe3-3257226.pdf?src-supplier=Avnet; ComponentLink11Description: https://datasheet.ciiva.com/3257/dcrcwe3-3257226.pdf?src-supplier=Avnet; Supplier 1: Digi-Key; Supplier Part Number 1: 541-1.00HCT-ND; Supplier 2: Newark; Supplier Part Number 2: 52K8059

## Nets that join several sheets
5V: Slit_Lamp_Schematic (8 pins), Motor_PCB (7 pins)
GND: Slit_Lamp_Schematic (13 pins), Motor_PCB (12 pins)
NetIC1_1: Slit_Lamp_Schematic (STEP_PINS.2), Motor_PCB (IC1.1)
NetIC1_3: Slit_Lamp_Schematic (STEP_PINS.3), Motor_PCB (IC1.3)
NetIC1_4: Slit_Lamp_Schematic (STEP_PINS.4), Motor_PCB (IC1.4)
NetIC1_6: Slit_Lamp_Schematic (STEP_PINS.1), Motor_PCB (IC1.6)
NetIC1_8: Slit_Lamp_Schematic (METRO_MINI.3), Motor_PCB (IC1.8)
NetIC1_9: Slit_Lamp_Schematic (METRO_MINI.4), Motor_PCB (IC1.9)
NetIC1_10: Slit_Lamp_Schematic (METRO_MINI.10), Motor_PCB (IC1.10)
NetIC1_11: Slit_Lamp_Schematic (METRO_MINI.8), Motor_PCB (IC1.11)
NetIC1_22: Slit_Lamp_Schematic (METRO_MINI.5), Motor_PCB (IC1.22 R2.1)